# EAGLE design connector2 (EAGLE 6.5.0)
Panel Connector Board
AUTHOR: Pasakorn Tiwatthanont; REV: 1
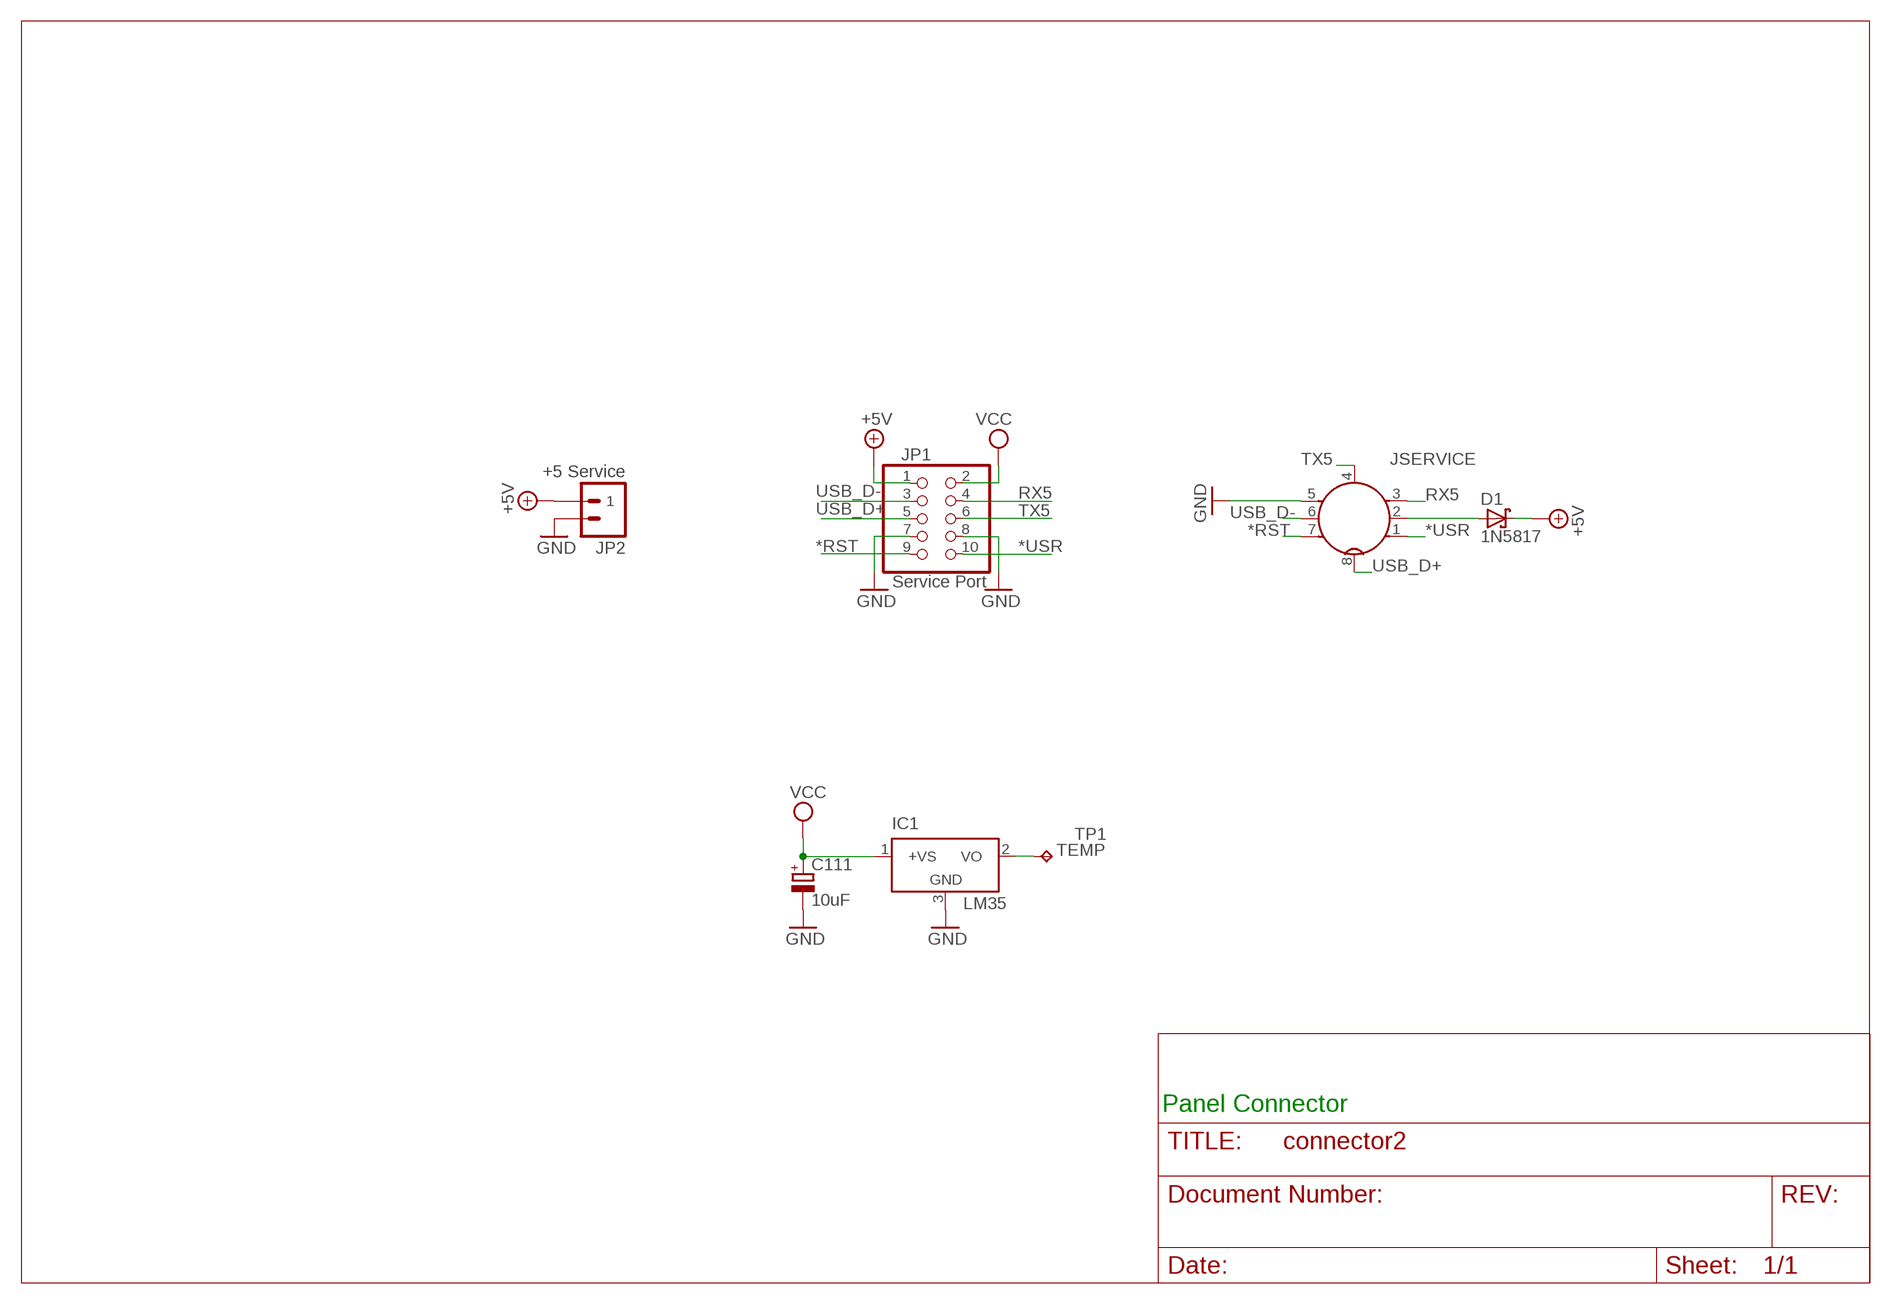
[diagram p0: schematic, sheet 1]

## Parts
C111  10uF  CPOL-EUE2,5-6E  [E2,5-6E]
D1  1N5817  1N5819-V  [DO41-150V]
IC1  LM35  [TO92-50]
JP1  Service Port  HEADER-2X5  [2X05]
JP2  +5 Service  M02POLAR  [MOLEX-1X2]
JSERVICE  MIC_CONN_MALE_8P  [MIC_CONN_MALE_8P]
TP1  TPPAD1-13  [P1-13]

## Nets
*RST: JP1.9 JSERVICE.7
*USR: JP1.10 JSERVICE.1
+5V: D1.C JP1.1 JP2.1
GND [power]: C111.- IC1.3(GND) JP1.7 JP1.8 JP2.2 JSERVICE.5
N$1: D1.A JSERVICE.2
N$3: IC1.2(VO) TP1.TP
RX5: JP1.4 JSERVICE.3
TX5: JP1.6 JSERVICE.4
USB_D+: JP1.5 JSERVICE.8
USB_D-: JP1.3 JSERVICE.6
VCC [power]: C111.+ IC1.1(+VS) JP1.2

## Notes on the sheet
- Panel Connector

## Library data of the parts
C111 = rcl:CPOL-EU: POLARIZED CAPACITOR, European symbol
D1 = ipas:1N5819: DIODE 1N5817 THRU 1N5819 1.0 AMP. Schottky Barrier Rectifiers Features Low forward voltage drop High current capability High reliability High surge current capability
IC1 = ipas:LM35: Precision Centigrade Temperature Sensors Features Calibrated directly in ̊ Celsius (Centigrade) Linear + 10.0 mV/ ̊C scale factor 0.5 ̊C accuracy guaranteeable (at +25 ̊C) Rated for full −55 ̊ to +150 ̊C range Suitable for remote applications Low cost due to wafer-level trimming Operates from 4 to 30 volts Less than 60 μA current drain Low self-heating, 0.08 ̊C in still air Nonlinearity only ± 1⁄4 ̊C typical Low impedance output, 0.1 Ω for 1 mA load The LM35 series are precision integrated-circuit temperature sensors, whose output voltage is linearly proportional to the Celsius (Centigrade) temperature. The LM35 thus has an advantage over linear temperature sensors calibrated in ̊ Kelvin, as the user is not required to subtract a large constant voltage from its output to obtain convenient Centi- grade scaling. The LM35 does not require any external calibration or trimming to provide typical accuracies of ± 1⁄4 ̊C at room temperature and ± 3⁄4 ̊C over a full −55 to +150 ̊C temperature range. Low cost is assured by trimming and calibration at the wafer level. The LM35’s low output imped- ance, linear output, and precise inherent calibration make interfacing to readout or control circuitry especially easy. It can be used with single power supplies, or with plus and minus supplies. As it draws only 60 μA from its supply, it has very low self-heating, less than 0.1 ̊C in still air. The LM35 is rated to operate over a −55 ̊ to +150 ̊C temperature range, while the LM35C is rated for a −40 ̊ to +110 ̊C range (−10 ̊ with improved accuracy). The LM35 series is available pack- aged in hermetic TO-46 transistor packages, while the LM35C, LM35CA, and LM35D are also available in the plastic TO-92 transistor package. The LM35D is also avail- able in an 8-lead surface mount small outline package and a plastic TO-220 package. Source: http://cache.national.com/ds/LM/LM50.pdf
JP1 = microbuilder:HEADER-2X5: PIN HEADER
JP2 = ipas:M02: Header 2 Standard 2-pin 0.1" header. Use with straight break away headers (SKU : PRT-00116), right angle break away headers (PRT-00553), swiss pins (PRT-00743), machine pins (PRT-00117), and female headers (PRT-00115). Molex polarized connector foot print use with SKU : PRT-08233 with associated crimp pins and housings.
JSERVICE = ipas:MIC_CONN_MALE_8P
TP1 = testpad:TP: Test pad; TP_SIGNAL_NAME: TEMP

## Net classes
0 default: width 0.254 mm
1 power: width 0.406 mm, clearance 0.203 mm

## Board
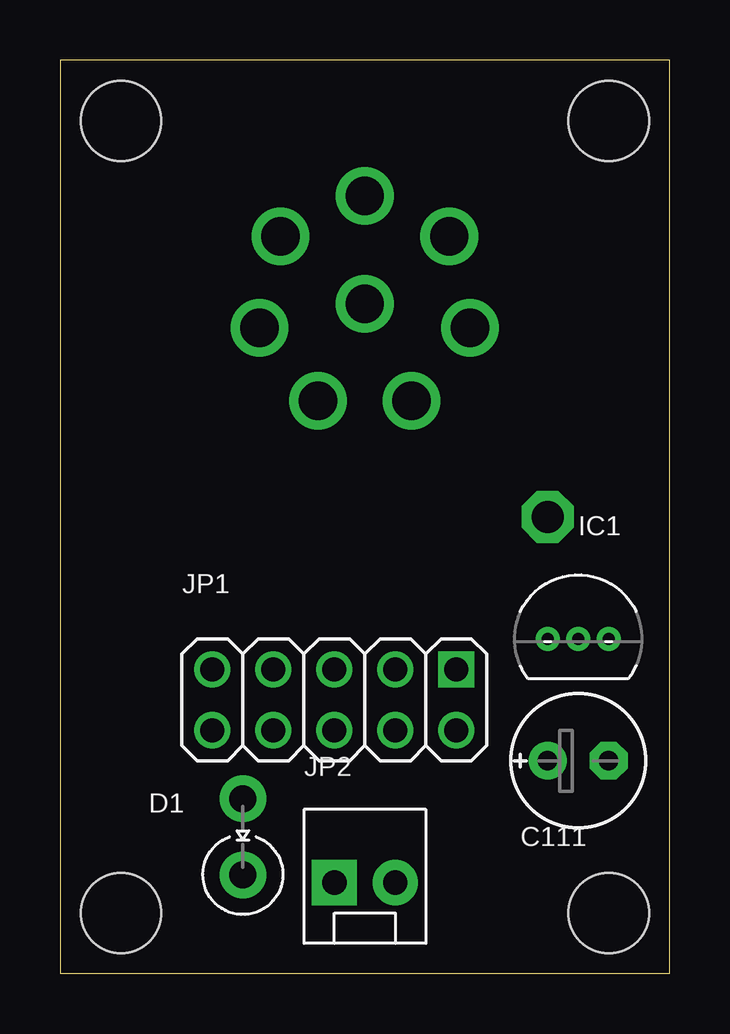
[diagram p1: board, top side]
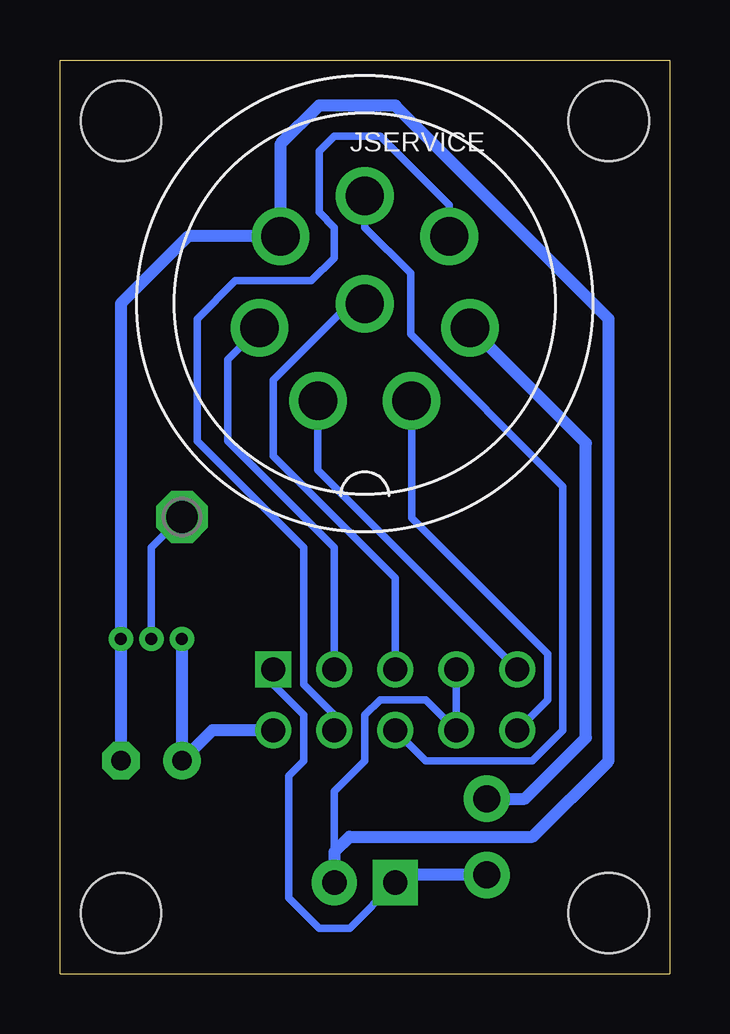
[diagram p2: board, bottom side, seen from below]

Size 25.4 x 38.1 mm. Coordinates in mm from the lower left corner, seen from the top.
Outline: 0,38.1 0,0 25.4,0 25.4,38.1 0,38.1
Copper layers (1*16): Top 0.035mm / dielectric 1.5mm / Bottom 0.035mm
Design rules "default *": minimum track width 10mil, minimum drill 24mil, track to track 10mil, track to pad 10mil, pad to pad 10mil, via to via 10mil, smd to smd 10mil, copper to edge 40mil, drill to drill 8mil, minimum pad ring 10mil, minimum via ring 8mil, stop-mask expansion 4mil, vias tented up to drill 0mil, thermal gap 10mil
Holes 3.35 mm at 2.54,2.54 22.86,2.54 22.86,35.56 2.54,35.56

### Footprints (pad centres in the part's own frame; a part is rotated, then mirrored left to right if it is on the bottom)
E2,5-6E = drill 0.813 pad 1.575: + -1.27,0 | drill 0.813 pad 1.575 octagon: - 1.27,0
DO41-150V = drill 1.118 pad 1.93: A 1.587,0; C -1.587,0
TO92-50 = drill 0.5: 1 -1.27,0; 2 0,0; 3 1.27,0
2X05 = drill 1 square: 1 -5.08,-1.27 | drill 1: 2 -5.08,1.27; 3 -2.54,-1.27; 4 -2.54,1.27; 5 0,-1.27; 6 0,1.27; 7 2.54,-1.27; 8 2.54,1.27; 9 5.08,-1.27; 10 5.08,1.27
MOLEX-1X2 = drill 1.016 pad 1.88 square: 1 0,0 | drill 1.016 pad 1.88: 2 2.54,0
MIC_CONN_MALE_8P = drill 1.6: 1 1.95,-4.05; 2 4.39,-1; 3 3.52,2.81; 4 0,4.5; 5 -3.52,2.81; 6 -4.39,-1; 7 -1.95,-4.05; 8 0,0
P1-13 = drill 1.321 pad 2.159 octagon: TP 0,0

### Placement (x,y rotation side)
C111  21.59,8.89 0 top
D1  7.62,5.71 90 top
IC1  21.59,13.97 0 top
JP1  11.43,11.43 180 top
JP2  11.43,3.81 0 top
JSERVICE  12.7,27.94 0 bottom
TP1  20.32,19.05 0 bottom

### Tracks (layer width: path | path; a pad name or v marks a point on that pad's centre or on a via)
*RST
  Bottom 0.305: JP1.9 14.65,21 JSERVICE.7
*USR
  Bottom 0.305: JP1.10 5.08,11.43 5.08,13.34 10.75,19 JSERVICE.1
+5V
  Bottom 0.305: JP1.1 16.51,12.06 15.24,10.79 15.24,8.89 15.88,8.26 15.88,3.17 14.61,1.91 13.34,1.91 JP2.1
  Bottom 0.508: D1.C 11.11,4.13 JP2.1
GND
  Bottom 0.305: JP1.7 JP1.8 10.16,11.43 12.06,11.43 12.7,10.79 12.7,8.89 13.97,7.62 13.97,5.08
  Bottom 0.508: C111.- IC1.3 22.86,27.94 20.05,30.75 JSERVICE.5 16.22,34.58 14.61,36.2 11.43,36.2 2.54,27.3 2.54,8.89 5.71,5.71 13.34,5.71 13.97,5.08 JP2.2
N$1
  Bottom 0.508: D1.A 6.03,7.3 3.49,9.84 3.49,22.12 JSERVICE.2
N$3
  Bottom 0.305: TP1.TP 21.59,17.78 IC1.2
RX5
  Bottom 0.305: JSERVICE.3 9.18,32.04 12.06,34.92 13.97,34.92 14.61,34.29 14.61,31.75 13.97,31.11 13.97,29.84 14.92,28.89 18.1,28.89 19.68,27.3 19.68,22.23 15.24,17.78 15.24,12.06 13.97,10.79 JP1.4
TX5
  Bottom 0.305: JSERVICE.4 12.7,31.11 10.79,29.21 10.79,26.67 4.45,20.32 4.45,10.16 5.71,8.89 10.16,8.89 JP1.6
USB_D+
  Bottom 0.305: JSERVICE.8 13.34,27.94 16.51,24.77 16.51,21.59 11.43,16.51 JP1.5
USB_D-
  Bottom 0.305: JSERVICE.6 18.41,25.61 18.41,22.23 13.97,17.78 JP1.3
VCC
  Bottom 0.508: IC1.1 C111.+ 19.05,10.16 JP1.2